# EAGLE design weblight (EAGLE 7.6.0)
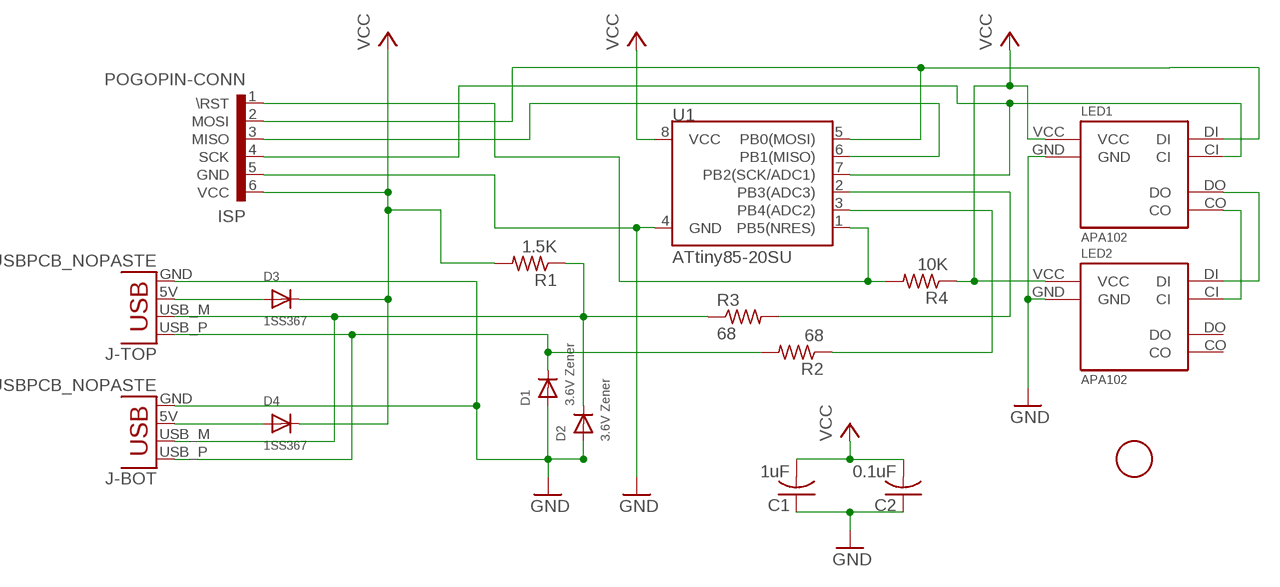
[diagram p0: schematic, sheet 1]

## Parts
C1  1uF  C-USC0805  [C0805]
C2  0.1uF  C-USC0805  [C0805]
D1  3.6V Zener  DIODESOD-323  [SOD-323]
D2  3.6V Zener  DIODESOD-323  [SOD-323]
D3  1SS367  DIODESOD-323  [SOD-323]
D4  1SS367  DIODESOD-323  [SOD-323]
FID1  FIDUCIAL  [FIDUCIAL_1MM]
ISP  POGOPIN-CONN  [POGOPROG-CONN-OH-SMALLERVIAS-NOCREAM]
J-BOT  USBPCB_NOPASTE  [USB-A-PCB-NOPASTE]
J-TOP  USBPCB_NOPASTE  [USB-A-PCB-NOPASTE]
LED1  APA102  [APA102]
LED2  APA102  [APA102]
R1  1.5K  R-US_R0805  [R0805]
R2  68  R-US_R0805  [R0805]
R3  68  R-US_R0805  [R0805]
R4  10K  R-US_R0805  [R0805]
U1  ATtiny85-20SU  ATTINY45TINY85-20-SMT  [SO08-EIAJ]

## Nets
5V-BOT: D4.A J-BOT.5V(VBUS)
5V-TOP: D3.A J-TOP.5V(VBUS)
CLK_1/SCK: ISP.4(SCK) LED1.CI U1.7(PB2(SCK/ADC1))
CLK_2: LED1.CO LED2.CI
DIN_1/MOSI: ISP.2(MOSI) LED1.DI U1.5(PB0(MOSI))
DIN_2: LED1.DO LED2.DI
GND: C1.1 C2.1 D1.A D2.A ISP.5(GND) J-BOT.GND J-TOP.GND LED1.GND LED2.GND U1.4(GND)
MISO: ISP.3(MISO) U1.6(PB1(MISO))
N_RESET: ISP.1(\RST) R4.2 U1.1(PB5(NRES))
USB_D_MINUS: R3.2 U1.2(PB3(ADC3))
USB_D_MINUS_RAW: D2.C J-BOT.USB_M(D-) J-TOP.USB_M(D-) R1.1 R3.1
USB_D_PLUS: R2.1 U1.3(PB4(ADC2))
USB_D_PLUS_RAW: D1.C J-BOT.USB_P(D+) J-TOP.USB_P(D+) R2.2
VCC: C1.2 C2.2 D3.C D4.C ISP.6(VCC) LED1.VCC LED2.VCC R1.2 R4.1 U1.8(VCC)
Unconnected: LED2.CO LED2.DO

## Library data of the parts
C1 C2 = rcl:C-US: CAPACITOR, American symbol
D1-D4 = microbuilder:DIODE: Diode SMA Model Volts Amps Type Vf Vr Digikey # Notes SSA34-E3 40V 3A Schottky 480mV @ 3A 200uA @ 40V SSA34-E3/61TGITR-ND CDBA120-G 20V 1A Schottky 500mV @ 1A 500uA @ 20V 641-1014-6-ND REEL MBRA210 10V 2A Schottky 350mV @ 2A 700uA @ 10V MBRA210LT3 SOD-123 Model Volts Amps Type Vf Vr Order # Notes BAT54T1G 30V 200mA Schottky 800mV @ 200mA 2uA @ 25V BAT54T1GOSTR-ND B0530W 30V 500mA Schottky 430mV @ 500mA 130uA @ 30V B0530W-FDICT-ND REEL MBR120 1A 20V Schottky 340mV @ 1A MBR120VLSFT1GOSCT-ND SOD-323 Model Volts Amps Type Vf Vr Order # Notes PMEG2005EJ 20V 500mA Schottky 355mV @ 500mA 568-4110-1-ND ZLLS410 10V 570mA Schottky 380mV @ 570mA ZLLS410CT-ND 1N4148WS 75V 150mA Silicon/Simple 1V 1N4148WSFSCT-ND REEL SOD-523 Model Volts Amps Type Vf Vr Order # Notes BAT54XV2 30V 200mA Schottky 0.8V @ 100mA BAT54XV2CT-ND TB751S 30V 30mA Schottky RB751S-40TE61CT-ND SOT23-R/W (R = Solder Paste/Reflow Ovens, W = Hand-Soldering) Model Volts Amps Type Vf Vr Order # Notes BAT54FILM 40V 300mA Schottky 497-7162-1-ND
FID1 = adafruit:FIDUCIAL: For use by pick and place machines to calibrate the vision/machine, 1mm By microbuilder.eu
ISP = weblight:POGOPIN-CONN: Protofusion custom pogo pin programming header
J-BOT J-TOP = SparkFun-Connectors:USB: USB Connectors USB-B-PTH is fully proven SKU : PRT-00139/CONN-08278 USB-miniB is fully proven SKU : PRT-00587 USB-A-PCB is untested. USB-A-H is throughly reviewed, but untested. Spark Fun Electronics SKU : PRT-00437 USB-B-SMT is throughly reviewed, but untested. Needs silkscreen touching up. USB-A-S has not been used/tested USB-MB-H has not been used/tested USB-MICROB has been used. CONN-09505
LED1 LED2 = weblight:APA102
R1-R4 = rcl:R-US_: RESISTOR, American symbol
U1 = SparkFun-DigitalIC:ATTINY45: Atmel 8-pin 2/4/8kB flash uC; PROD_ID: IC-09092; VALUE: Tiny85-20-SMT

## Board
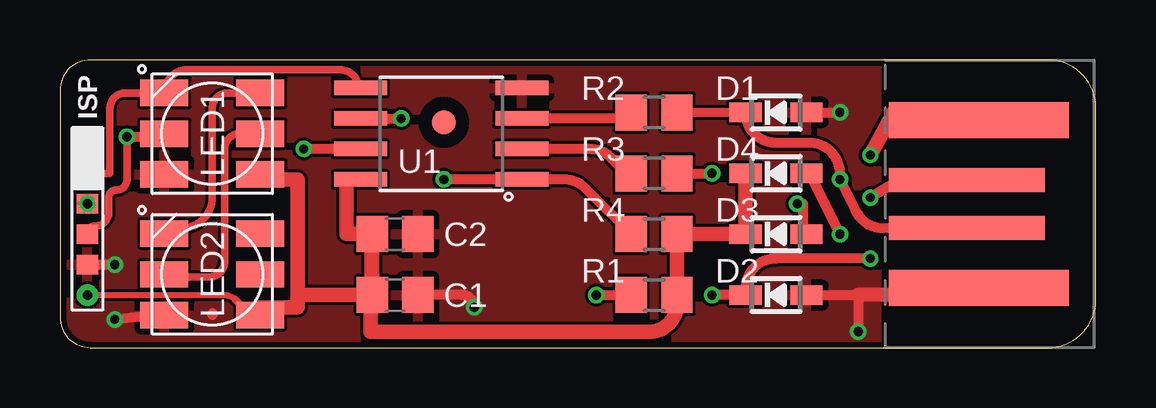
[diagram p1: board, top side]
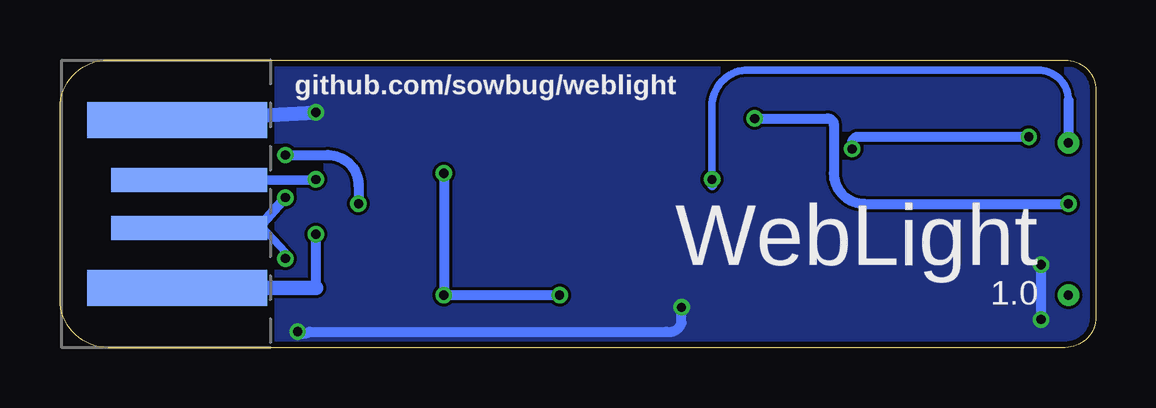
[diagram p2: board, bottom side, seen from below]

Size 43.18 x 12 mm. Coordinates in mm from the lower left corner, seen from the top.
Outline: 1.27,0 41.18,0 arc90 43.18,2 43.18,10 arc90 41.18,12 1.27,12 arc90 0,10.73 0,1.27 arc90 1.27,0
Copper layers (1*16): Top 0.035mm / dielectric 1.5mm / Bottom 0.035mm
Design rules "dirt_cheap_dirty_boards.v1": minimum track width 5mil, minimum drill 12mil, track to track 5mil, track to pad 5mil, pad to pad 5mil, via to via 5mil, smd to smd 0mil, copper to edge 10mil, drill to drill 10mil, minimum pad ring 10mil, minimum via ring 6mil, stop-mask expansion 2mil, vias tented up to drill 25mil, thermal gap 10mil
vRestrict: area 34.3,-0.1 to 43.2,11.9

### Footprints (pad centres in the part's own frame; a part is rotated, then mirrored left to right if it is on the bottom)
C0805 = smd 1.3 x 1.5: 1 -0.95,0; 2 0.95,0
SOD-323 = smd 1.35 x 0.8: A 1.27,0; C -1.27,0
FIDUCIAL_1MM = smd 1 x 1: 1 0,0
POGOPROG-CONN-OH-SMALLERVIAS-NOCREAM = drill 0.381: 1 0,2.54; 6 0,-3.81 | smd 0.889 x 0.813: 2 0,1.27; 3 0,0; 4 0,-1.27; 5 0,-2.54
USB-A-PCB-NOPASTE = smd 7.5 x 1.5: 5V -0.2,-3.5; GND -0.2,3.5 | smd 6.5 x 1: USB_M 0.3,-1; USB_P 0.3,1
APA102 = smd 2 x 1.1: CI 2,0; CO -2,0; DI 2,-1.7; DO -2,-1.7; GND 2,1.7; VCC -2,1.7
R0805 = smd 1.3 x 1.5: 1 -0.95,0; 2 0.95,0
SO08-EIAJ = smd 0.61 x 2.21: 1 -1.905,-3.378; 2 -0.635,-3.378; 3 0.635,-3.378; 4 1.905,-3.378; 5 1.905,3.353; 6 0.635,3.353; 7 -0.635,3.353; 8 -1.905,3.353

### Placement (x,y rotation side)
C1  13.97,2.19 180 top
C2  13.97,4.73 180 top
D1  29.84,9.81 0 top
D2  29.84,2.19 0 top
D3  29.84,4.73 0 top
D4  29.84,7.27 0 top
FID1  16,9.4 0 top
ISP  1.14,6 0 top
J-BOT  38.1,6 0 bottom
J-TOP  38.1,6 180 top
LED1  6.35,8.92 180 top
LED2  6.35,3.05 180 top
R1  24.77,2.19 0 top
R2  24.77,9.81 0 top
R3  24.77,7.27 180 top
R4  24.77,4.73 180 top
U1  15.88,8.92 90 top

### Tracks (layer width: path | path; a pad name or v marks a point on that pad's centre or on a via)
5V-BOT  (via drill 0.38)
  Top 0.406: v32.51,4.73 31.24,7.27 D4.A
  Bottom 0.406: 32.51,2.5 v32.51,4.73
  Bottom 0.61: J-BOT.5V 32.51,2.5
5V-TOP  (via drill 0.38)
  Top 0.406: D3.A 30.99,4.73 30.99,6 v30.73,6 | 34.8,9.91 38.1,9.91 J-TOP.5V
  Top 0.61: 34.8,9.91 v33.78,8.03
  Bottom 0.406: v33.78,8.03 32,8.03 arc90 30.73,6.76 v30.73,6
CLK_1/SCK  (via drill 0.38)
  Top 0.305: v2.79,8.79 2.79,7.02 arc-90 2.35,6.57 arc90 2.03,6.25 2.03,5.62 arc-90 1.49,5.08 arc90 ISP.4
  Top 0.406: U1.7 v10.16,8.29 | ISP.4 1.27,4.73 | v2.79,8.79 4.22,8.79 arc90 LED1.CI
  Bottom 0.406: v10.16,8.29 10.16,8.54 arc90 9.91,8.79 v2.79,8.79 2.74,8.79
CLK_2
  Top 0.305: LED1.CO 7.49,8.92 arc90 6.86,8.29 6.86,3.59 arc-90 6.22,2.95 4.35,2.95 LED2.CI
DIN_1/MOSI
  Top 0.305: U1.5 12.45,10.83 arc90 11.68,11.59 5.32,11.59 arc90 LED1.DI 2.72,10.62 arc90 2.08,9.99 2.08,7.27 ISP.2
DIN_2
  Top 0.305: LED1.DO 6.99,10.62 arc90 6.35,9.99 6.35,6.25 arc-90 5.08,4.98 4.35,4.98 LED2.DI
GND  (via drill 0.38)
  Top 0.152: 4.42,1.48 LED2.GND
  Top 0.406: v2.29,1.17 4.35,1.43 LED2.GND | 6.35,1.35 6.35,1.43 | ISP.5 v2.29,3.46 | D1.A v32.51,9.81 | D2.A 33.27,2.19 v33.27,0.67 | J-TOP.GND 38.61,2.29 | v17.27,1.68 arc90 16.76,2.19 C1.1
  Top 0.61: 38.61,2.29 33.27,2.19
  Bottom 0.406: v2.29,3.46 v2.29,1.17 | J-BOT.GND 35.45,9.65 v32.51,9.81 | v33.27,0.67 33.21,0.6 arc-45 32.76,0.67 17.91,0.67 arc-90 17.27,1.05 v17.27,1.68
  Bottom 0.61: v32.51,9.81 J-BOT.GND
  pour Top (rank 6): -0.64,12.32 34.04,12.32 34.04,-0.64 -0.64,-0.64
  pour Bottom (rank 6): -1.27,12.95 34.04,12.95 34.04,-1.27 -1.27,-1.27
MISO  (via drill 0.38)
  Top 0.406: U1.6 v14.22,9.56
  Bottom 0.406: v14.22,9.56 11.18,9.56 arc90 10.92,9.3 10.92,7.27 arc-90 9.65,6 ISP.3
  other vias: 1.14,6
N_RESET  (via drill 0.38)
  Top 0.406: v16,7.02 U1.1 21,7.02 arc-45 21.9,6.64 R4.2
  Bottom 0.305: 16,6.76 16,10.06 arc90 14.48,11.58 2.41,11.58 arc90 1.14,10.32
  Bottom 0.406: v16,7.02 16,6.76 | 1.14,10.32 ISP.1
USB_D_MINUS
  Top 0.381: R3.2 23.62,7.27 | 19.56,8.29 U1.2
  Top 0.406: 23.62,7.27 22.98,7.91 arc45 22.08,8.29 U1.2
USB_D_MINUS_RAW  (via drill 0.38)
  Top 0.406: v27.18,2.19 D2.C 28.57,2.44 arc-90 29.84,3.71 v33.78,3.71 | v22.35,2.19 R1.1 | R3.1 v27.18,7.27 | J-TOP.USB_M 34.8,6.86 v33.78,6.25
  Bottom 0.305: v33.78,3.71 33.78,3.97 34.8,5.08
  Bottom 0.406: v22.35,2.19 v27.18,2.19 v27.18,7.27 | v33.78,6.25 35.05,4.83 J-BOT.USB_M 34.8,5.08 35.81,5.08
USB_D_PLUS
  Top 0.406: 23.88,9.81 R2.1 23.37,9.81 23.37,9.56 U1.3
USB_D_PLUS_RAW  (via drill 0.38)
  Top 0.381: D1.C R2.2
  Top 0.406: D1.C 28.59,9.68 arc84 29.85,8.54 31.24,8.54 arc-90 32.51,7.27 v32.51,7.02 33.18,5.69 arc63 34.31,4.98 36.24,5.08 arc45 J-TOP.USB_P
  Bottom 0.406: J-BOT.USB_P v32.51,7.02
VCC
  Top 0.254: 8.35,1.68 7.62,1.68 | ISP.6 6.85,2.19 arc-45 7.3,2
  Top 0.305: 7.3,2 7.62,1.68
  Top 0.381: C1.2 12.95,2.19 | 8.35,7.02 LED1.VCC | 8.35,1.68 LED2.VCC
  Top 0.406: 8.35,7.02 8.38,7.02
  Top 0.61: D4.C D3.C R4.1 R1.2 25.71,1.68 arc-90 24.45,0.67 12.95,0.67 | 12.95,0.67 12.95,2.19 9.91,2.19 | C2.2 12.95,4.73 | U1.8 11.94,7.02 11.94,4.73 C2.2 | 8.35,1.68 9.91,1.68 9.91,2.19 | C2.2 C1.2 | C2.2 12.95,0.67 | 8.38,7.02 9.91,7.02 9.91,2.19

### Text on the board
bNames: github.com/sowbug/weblight | WebLight | 1.0